# EAGLE design usb-to-serial (EAGLE 9.5.0)
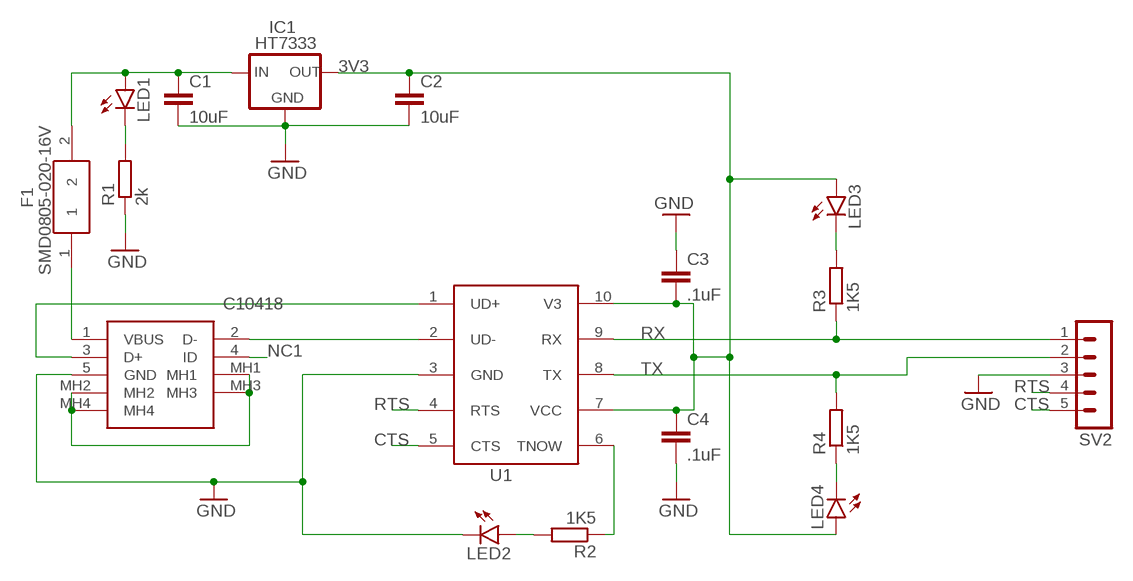
[diagram p0: schematic, sheet 1]

## Parts
C1  10uF  C-EUC0805  [C0805]
C2  10uF  C-EUC0805  [C0805]
C3  .1uF  C-EUC0805  [C0805]
C4  .1uF  C-EUC0805  [C0805]
F1  SMD0805-020-16V  [FUSC2114X100N]
IC1  HT7333  [SOT-89]
J1  C10418  [C10418]
LED1  LEDCHIP-LED0805  [CHIP-LED0805]
LED2  LEDCHIP-LED0805  [CHIP-LED0805]
LED3  LEDCHIP-LED0805  [CHIP-LED0805]
LED4  LEDCHIP-LED0805  [CHIP-LED0805]
R1  2k  R-EU_R0805  [R0805]
R2  1K5  R-EU_R0805  [R0805]
R3  1K5  R-EU_R0805  [R0805]
R4  1K5  R-EU_R0805  [R0805]
SV2  MA05-1  [MA05-1]
U1  CH340ESMD  [MSOP10]

## Nets
3V3: C2.1 C3.2 C4.1 IC1.1(OUT) LED3.A LED4.A U1.7(VCC) U1.10(V3)
+5V: C1.1 F1.2 IC1.3(IN) IC1.4(IN) LED1.A
CTS: SV2.5 U1.5(CTS)
D+: J1.3(D+) U1.1(UD+)
D-: J1.2(D-) U1.2(UD-)
GND: C1.2 C2.2 C3.1 C4.2 IC1.2(GND) J1.5(GND) LED2.C R1.1 SV2.3 U1.3(GND)
MH: J1.MH1 J1.MH2 J1.MH3 J1.MH4
N$1: F1.1 J1.1(VBUS)
N$2: LED1.C R1.2
N$3: R2.1 U1.6(TNOW)
N$4: LED2.A R2.2
N$5: LED3.C R3.2
N$6: LED4.C R4.1
NC1: J1.4(ID)
RTS: SV2.4 U1.4(RTS)
RX: R3.1 SV2.1 U1.9(RX)
TX: R4.2 SV2.2 U1.8(TX)

## Library data of the parts
C1-C4 = rcl:C-EU: CAPACITOR, European symbol; SPICEPREFIX: C
F1 = water-lib:SMD0805-020-16V: PTC Resettable Fuses 0805 RoHS Source: Datasheet <https://datasheet.lcsc.com/szlcsc/TECHFUSE-SMD0805-020-16V_C70057.pdf>; DESCRIPTION: PTC Resettable Fuses 0805 RoHS; HEIGHT: 1mm; MANUFACTURER_NAME: TECHFUSE; MANUFACTURER_PART_NUMBER: SMD0805-020-16V
IC1 = water-lib:HT73*
J1 = water-lib:C10418: USB Connectors SMD RoHS Source: Datasheet <https://datasheet.lcsc.com/szlcsc/Jing-Extension-of-the-Electronic-Co-LCSC-MICRO-USB-5S-B-Type-horns-High-temperature_C10418.pdf>; DESCRIPTION: USB Connectors SMD RoHS; HEIGHT: 3.15mm; MANUFACTURER_NAME: Jing Extension of the Electronic Co.; MANUFACTURER_PART_NUMBER: C10418
LED1-LED4 = led:LED: LED OSRAM: - CHIPLED LG R971, LG N971, LY N971, LG Q971, LY Q971, LO R971, LY R971 LH N974, LH R974 LS Q976, LO Q976, LY Q976 LO Q996 - Hyper CHIPLED LW Q18S LB Q993, LB Q99A, LB R99A - SideLED LS A670, LO A670, LY A670, LG A670, LP A670 LB A673, LV A673, LT A673, LW A673 LH A674 LY A675 LS A676, LA A676, LO A676, LY A676, LW A676 LS A679, LY A679, LG A679 - Hyper Micro SIDELED® LS Y876, LA Y876, LO Y876, LY Y876 LT Y87S - SmartLED LW L88C, LW L88S LB L89C, LB L89S, LG L890 LS L89K, LO L89K, LY L89K LS L896, LA L896, LO L896, LY L896 - TOPLED LS T670, LO T670, LY T670, LG T670, LP T670 LSG T670, LSP T670, LSY T670, LOP T670, LYG T670 LG T671, LOG T671, LSG T671 LB T673, LV T673, LT T673, LW T673 LH T674 LS T676, LA T676, LO T676, LY T676, LB T676, LH T676, LSB T676, LW T676 LB T67C, LV T67C, LT T67C, LS T67K, LO T67K, LY T67K, LW E67C LS E67B, LA E67B, LO E67B, LY E67B, LB E67C, LV E67C, LT E67C LW T67C LS T679, LY T679, LG T679 LS T770, LO T770, LY T770, LG T770, LP T770 LB T773, LV T773, LT T773, LW T773 LH T774 LS E675, LA E675, LY E675, LS T675 LS T776, LA T776, LO T776, LY T776, LB T776 LHGB T686 LT T68C, LB T68C - Hyper Mini TOPLED® LB M676 - Mini TOPLED Santana® LG M470 LS M47K, LO M47K, LY M47K Source: http://www.osram.convergy.de LUXEON: - LUMILED® LXK2-PW12-R00, LXK2-PW12-S00, LXK2-PW14-U00, LXK2-PW14-V00 LXK2-PM12-R00, LXK2-PM12-S00, LXK2-PM14-U00 LXK2-PE12-Q00, LXK2-PE12-R00, LXK2-PE12-S00, LXK2-PE14-T00, LXK2-PE14-U00 LXK2-PB12-K00, LXK2-PB12-L00, LXK2-PB12-M00, LXK2-PB14-N00, LXK2-PB14-P00, LXK2-PB14-Q00 LXK2-PR12-L00, LXK2-PR12-M00, LXK2-PR14-Q00, LXK2-PR14-R00 LXK2-PD12-Q00, LXK2-PD12-R00, LXK2-PD12-S00 LXK2-PH12-R00, LXK2-PH12-S00 LXK2-PL12-P00, LXK2-PL12-Q00, LXK2-PL12-R00 Source: www.luxeon.com KINGBRIGHT: KA-3528ASYC Source: www.kingbright.com
R1-R4 = rcl:R-EU_: RESISTOR, European symbol; SPICEPREFIX: R
SV2 = con-lstb:MA05-1: PIN HEADER; OC_FARNELL: unknown; OC_NEWARK: unknown
U1 = water-lib:CH340E: WCH.CN/CH340E See DataSheet： wch.cn <http://www.wch.cn/downloads/CH340DS1_PDF.html>

## Board
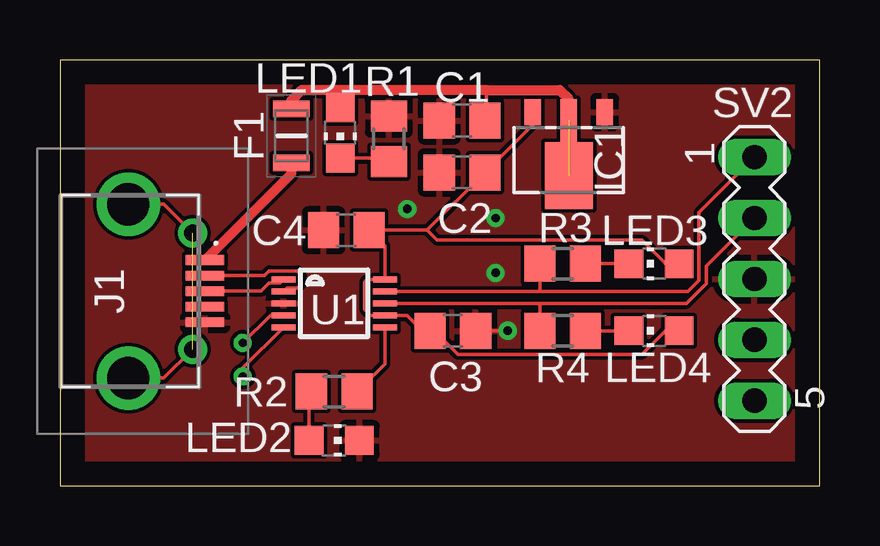
[diagram p1: board, top side]
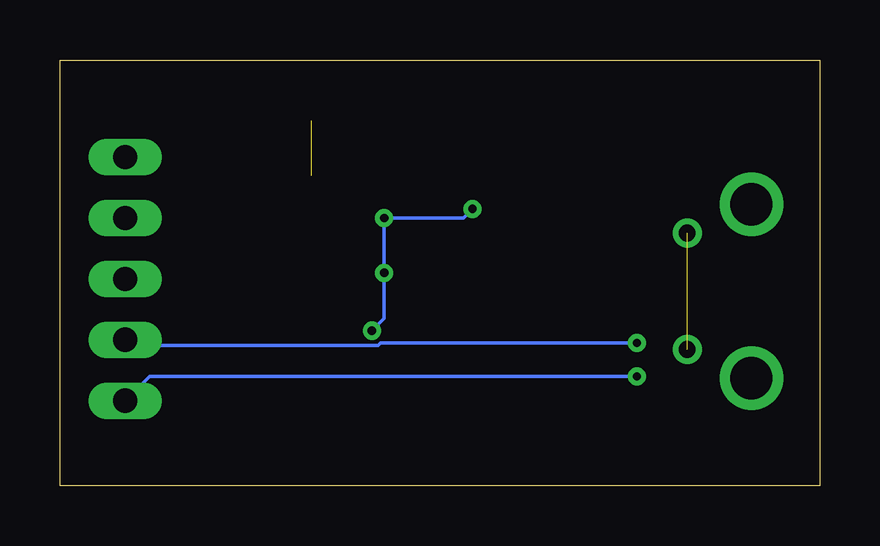
[diagram p2: board, bottom side, seen from below]

Size 31.67 x 17.77 mm. Coordinates in mm from the lower left corner, seen from the top.
Outline: 0,0 31.67,0 31.67,17.77 0,17.77 0,0
Copper layers (1*16): Top 0.035mm / dielectric 1.5mm / Bottom 0.035mm
Design rules "default": minimum track width 6mil, minimum drill 0.35mm, track to track 6mil, track to pad 6mil, pad to pad 6mil, via to via 6mil, smd to smd 6mil, copper to edge 40mil, drill to drill 6mil, minimum pad ring 10mil, minimum via ring 8mil, stop-mask expansion 4mil, vias tented up to drill 0mil, thermal gap 10mil

### Footprints (pad centres in the part's own frame; a part is rotated, then mirrored left to right if it is on the bottom)
C0805 = smd 1.3 x 1.5: 1 -0.95,0; 2 0.95,0
FUSC2114X100N = smd 0.68 x 1.52: 1 -1.125,0; 2 1.125,0
SOT-89 = smd 0.7 x 1.1: 1 1.5,-2.385; 2 -1.5,-2.385 | smd 0.7 x 1.8: 3 0,-2.035 | smd 2 x 2.8: 4 0,0.265
C10418 = smd 0.4 x 1.6: 1 1.3,-3; 2 0.65,-3; 3 0,-3; 4 -0.65,-3; 5 -1.3,-3 | drill 1.76 pad 2.64: MH1 -3.625,0.2; MH2 3.625,0.2 | drill 0.7 pad 1.2: MH3 -2.425,-2.48; MH4 2.425,-2.48
CHIP-LED0805 = smd 1.2 x 1.2: A 0,-1.05; C 0,1.05
R0805 = smd 1.3 x 1.5: 1 -0.95,0; 2 0.95,0
MA05-1 = drill 1.016 long: 1 -5.08,0; 2 -2.54,0; 3 0,0; 4 2.54,0; 5 5.08,0
MSOP10 = smd 1 x 0.25: 1 -2.113,1; 2 -2.113,0.5; 3 -2.113,0; 4 -2.113,-0.5; 5 -2.113,-1; 6 2.113,-1; 7 2.113,-0.5; 8 2.113,0; 9 2.113,0.5; 10 2.113,1

### Placement (x,y rotation side)
C1  16.76,15.24 180 top
C2  16.76,13.08 180 top
C3  16.38,6.48 180 top
C4  11.94,10.67 180 top
F1  9.65,14.61 90 top
IC1  21.21,13.21 180 top
J1  3.05,8.13 90 top
LED1  11.68,14.73 180 top
LED2  11.43,1.91 270 top
LED3  24.77,9.27 90 top
LED4  24.77,6.48 90 top
R1  13.72,14.48 270 top
R2  11.43,3.94 180 top
R3  20.95,9.27 0 top
R4  20.95,6.48 180 top
SV2  28.96,8.64 270 top
U1  11.43,7.62 0 top

### Tracks (layer width: path | path; a pad name or v marks a point on that pad's centre or on a via)
3V3
  Top 0.152: C4.1 13.28,10.67 | LED3.A 25.24,9.27 24.26,10.25 15.72,10.25 15.3,10.67 | IC1.1 19.71,15.08 C2.1 15.3,10.67 | 15.3,10.67 C4.1 | C4.1 13.54,10.01 U1.10 12.81,8.62 12.7,8.51 12.7,7.37 12.95,7.11 U1.7 14.47,7.12 15.11,6.48 C3.2 15.61,6.48 16.59,5.5 24.26,5.5 25.24,6.48 LED4.A
+5V  (1 unrouted)
  Top 0.152: 17.78,16.51 17.78,15.31 C1.1 | LED1.A 11.43,16.04 11.43,16.51
  Top 0.406: IC1.3 21.21,16.13 20.83,16.51 17.78,16.51 11.43,16.51 10.08,16.51 9.65,16.08 F1.2
CTS  (via drill 0.35)
  Top 0.152: U1.5 7.62,4.92 v7.62,4.57
  Bottom 0.152: v7.62,4.57 27.94,4.57 SV2.5
D+
  Top 0.152: U1.1 9.17,8.47 8.72,8.47 8.38,8.13 J1.3
D-
  Top 0.152: J1.2 8.53,8.78 8.72,8.97 9.91,8.97 10.05,8.84 10.05,8.4 9.91,8.27 9.46,8.27 U1.2
GND  (via drill 0.35)
  Top 0.152: C3.1 v18.67,6.48 | v14.48,11.56 14.48,11.74
  Bottom 0.152: v18.67,6.48 18.16,6.99 v18.16,8.89 v18.16,11.18 14.86,11.18 v14.48,11.56
  pour Top: -1.27,19.05 33.02,19.05 33.02,-1.27 -1.27,-1.27
MH  (1 unrouted)
  Top 0.152: J1.MH4 4.33,11.75 J1.MH2 | J1.MH1 4.33,4.5 J1.MH3
N$1
  Top 0.406: J1.1 9.65,13.03 F1.1
N$2
  Top 0.152: LED1.C 13.56,13.68 R1.2
N$3
  Top 0.152: 13.7,6.62 U1.6 13.54,5.1 R2.1
N$4
  Top 0.152: LED2.A 10.38,3.84 R2.2
N$5
  Top 0.152: R3.2 LED3.C
N$6
  Top 0.152: R4.1 LED4.C
RTS  (via drill 0.35)
  Top 0.152: U1.4 8.77,7.12 v7.62,5.97
  Bottom 0.152: v7.62,5.97 18.32,5.97 18.42,5.87 28.73,5.87 SV2.4
RX
  Top 0.152: U1.9 20.07,8.12 | R3.1 20,8.18 20.07,8.12 | SV2.1 26.64,11.4 26.64,8.58 26.19,8.12 20.07,8.12
TX
  Top 0.152: U1.8 20.07,7.62 | 20.07,7.62 26.12,7.62 26.95,8.45 26.95,9.17 SV2.2 | R4.2 20,7.56 20.07,7.62